# EasyEDA Pro project LF3.eprj

# Schematic Schematic1
Create Date: 2024-04-19; Page Name: P1; Project Name: LF3; Schematic Name: Schematic1; Update Date: 2025-01-10; Company: EasyEDA.com; Drawn: EasyEDA; Page Size: A4; Part Number: JLCPCB-002; Reviewed: EasyEDA; Version: V0.1
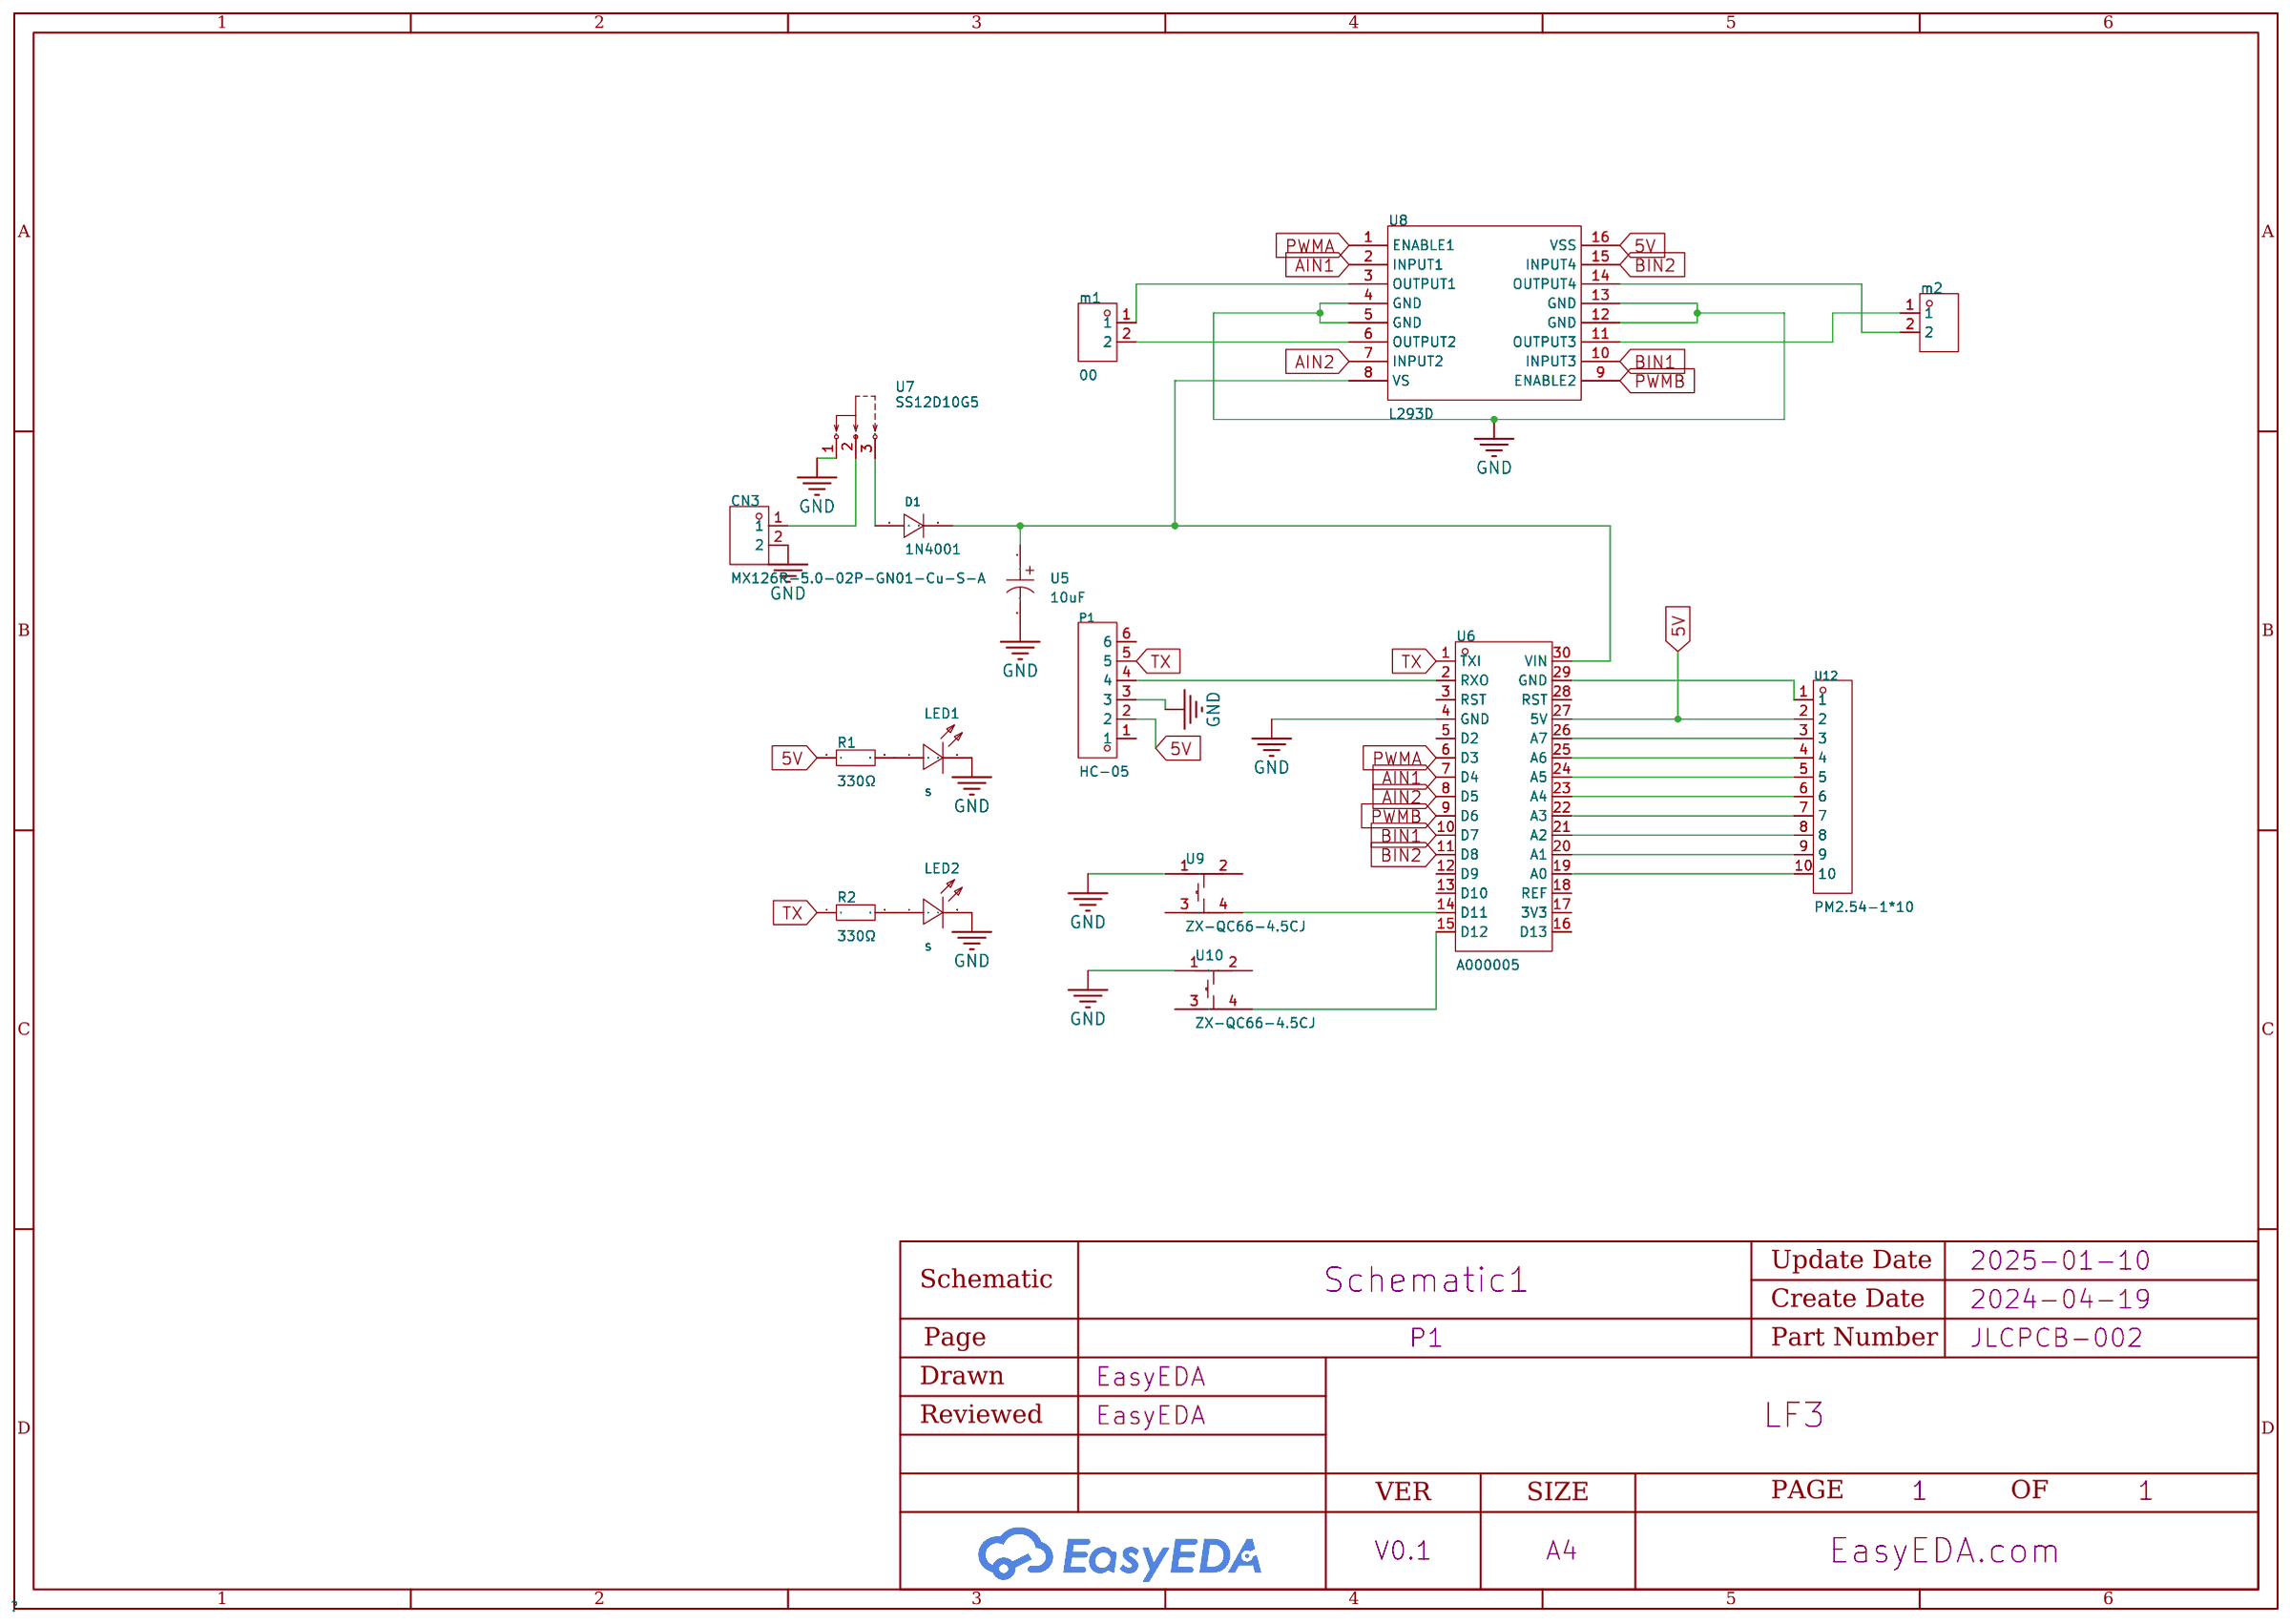
[diagram p0: schematic sheet]

## Parts
CN3  MX126R-5.0-02P-GN01-Cu-S-A  [CONN-TH_2P-P5.00-L10.0-W10.3]
D1  1N4001  [DO-41_BD2.4-L4.7-P8.70-D0.9-RD]
LED1  s  [LED-TH_BD3.8-P2.54-FD]
LED2  s  [LED-TH_BD3.8-P2.54-FD]
m1  00  [CONN-TH_2P-P5.00-L10.0-W10.3]
m2  MX126R-5.0-02P-GN01-Cu-S-A  [CONN-TH_2P-P5.00-L10.0-W10.3]
P1  HC-05  [HDR-TH_6P-P2.54-V-F]
R1  330Ω  [RES-TH_BD1.9-L3.3-P7.30-D0.5]
R2  330Ω  [RES-TH_BD1.9-L3.3-P7.30-D0.5]
U5  10uF  [CAP-TH_BD5.0-P2.00-D0.5-FD]
U6  A000005  [COMM-TH_A000005]
U7  SS12D10G5  [SW-TH_SHOU-HAN_SS12D10G4]
U8  L293D  [DIP-16_L20.0-W6.4-P2.54-LS7.6-BL]
U9  ZX-QC66-4.5CJ  [KEY-TH_4P-L6.0-W6.0-P4.50-LS6.50]
U10  ZX-QC66-4.5CJ  [KEY-TH_4P-L6.0-W6.0-P4.50-LS6.50]
U12  PM2.54-1*10  [HDR-TH_10P-P2.54-V-F]

## Library data of the parts
CN3 m1 m2 = MX126R-5.0-02P-GN01-Cu-S-A: Structure:1x2P Pitch:5mm Color:Green Mounting Style:Right-Angle Current Rating (Max):10A Voltage Rating (Max):300V Number of Pins:2P Number of Rows:1 Wire Gauge - AWG:14~26 Wire Gauge - AWG:14~26 Wire Gauge - mm2:2.5 Wire Gauge - mm2:2.5 Number of PINs Pe; LCSC Part Name: 5mm 1x2P 排数:1 每排P数:2 弯插; Supplier Part: C5188436; Manufacturer: MAX(迈旭); Supplier Footprint: 弯插,P=5mm; JLCPCB Part Class: Extended Part; Datasheet: https://atta.szlcsc.com/upload/public/pdf/source/20230914/18F586B283DF68255D5688C19743BDDA.pdf; Supplier: LCSC; Structure: 1x2P; Pitch: 5mm; Color: Green; Mounting Style: Right-Angle; Current Rating (Max): 10A; Voltage Rating (Max): 300V; Number of Pins: 2P; Number of Rows: 1; Wire Gauge - AWG: 14~26; Wire Gauge - mm2: 2.5; Number of PINs Per Row: 2; Contact Material: Copper Alloy; Contact Plating: Tin; Operating Temperature Range: -40℃~+105℃
D1 = 1N4001_C169150: Diode Configuration: Forward Voltage (Vf@If): Reverse Voltage (Vr): Average Rectified Current (Io): Reverse Leakage Current:; LCSC Part Name: 电压:50V 电流:1A; Supplier Part: C169150; Manufacturer: DIOFIT(對餘科技); Supplier Footprint: DO-41; JLCPCB Part Class: Extended Part; Datasheet: https://atta.szlcsc.com/upload/public/pdf/source/20180130/C169150_15172973997661323403.pdf; Supplier: LCSC
LED1 LED2 = TJ-L3FYTLDRMFCSFLC2R-A5: Lamp Holder Type:3mm圆形灯头 Emitted Color:橙红色 Power Dissipation:72mW Forward Current:20mA Dominant Wavelength:620nm~630nm Dominant Wavelength:620nm~630nm Peak Wavelength:630nm Diode Configuration:- Lens Color:雾状红透镜 Color Temperature:- Color Temperature:- Vie; LCSC Part Name: 橙红; Supplier Part: C440523; Manufacturer: TOGIALED(统佳); Supplier Footprint: 插件,D=3mm; JLCPCB Part Class: Extended Part; Datasheet: https://atta.szlcsc.com/upload/public/pdf/source/20191029/C440523_9662C3EC1D82ED90715B43211F389690.pdf; Supplier: LCSC; Lamp Holder Type: 3mm圆形灯头; Emitted Color: 橙红色; Power Dissipation: 72mW; Forward Current: 20mA; Dominant Wavelength: 620nm~630nm; Peak Wavelength: 630nm; Lens Color: 雾状红透镜; Viewing Angle: 45°; Operating Temperature: -20℃~+80℃
P1 = 2.54-1*6P母: Holes Structure:1x6P Pitch:2.54mm Row Spacing:- Mounting Type:Straight Number of Rows:Plugin Number of Holes:6P Insulation Height:- Contact Material:- Contact Plating:-; LCSC Part Name: 间距:2.54mm 1x6P 直插; Supplier Part: C40877; Manufacturer: BOOMELE(博穆精密); Supplier Footprint: 插件,P=2.54mm; JLCPCB Part Class: Extended Part; Datasheet: https://atta.szlcsc.com/upload/public/pdf/source/20210301/C2718488_F4427B881E42CAA8DDB0B1C12B3A522C.pdf; Supplier: LCSC; Holes Structure: 1x6P; Pitch: 2.54mm; Mounting Type: Straight; Number of Rows: Plugin; Number of Holes: 6P
R1 R2 = RN16T25800F: Type:Metal Film Resistors Resistance: Tolerance:±1% Tolerance:±1% Overload Voltage (Max):250V Temperature Coefficient:±100ppm/℃ Temperature Coefficient:±100ppm/℃ Operating Temperature Range:-55℃~+155℃ Operating Temperature Range:-55℃~+155℃; LCSC Part Name: 金属膜电阻 580Ω ±1%; Supplier Part: C172577; Manufacturer: 大毅科技; Supplier Footprint: 插件; JLCPCB Part Class: Extended Part; Datasheet: https://atta.szlcsc.com/upload/public/pdf/source/20180301/C172697_15198943829781383924.pdf; Supplier: LCSC; Type: Metal Film Resistors; Tolerance: ±1%; Overload Voltage (Max): 250V; Temperature Coefficient: ±100ppm/℃; Operating Temperature Range: -55℃~+155℃
U5 = 152EC0400: Capacitance: Tolerance:±20% Tolerance:±20% Rated Voltage: Ripple Current:54mA@100kHz Equivalent Series Resistance(ESR):- Lead Spacing:2mm φD: L: Lifetime @ Temp:2000hrs@105℃ Operating Temperature:-40℃~+105℃ Operating Temperature:-40℃~+105℃; LCSC Part Name: 10uF ±20% 50V; Supplier Part: C6718381; Manufacturer: KNSCHA(科尼盛); Supplier Footprint: 插件,D5xL11mm; JLCPCB Part Class: Extended Part; Datasheet: https://atta.szlcsc.com/upload/public/pdf/source/20230526/9565C444B97D7BF0133FD5A83BACB2AC.pdf; Supplier: LCSC; Tolerance: ±20%; Ripple Current: 54mA@100kHz; Lead Spacing: 2mm; Lifetime @ Temp: 2000hrs@105℃; Operating Temperature: -40℃~+105℃
U6 = A000005: Supplier Part: C19189484; Manufacturer: arduino; JLCPCB Part Class: Extended Part; Datasheet: https://atta.szlcsc.com/upload/public/pdf/source/20240327/42B4B7387607EBC2A03270056B7E63CD.pdf; Supplier: LCSC
U7 = SS12D10G5: Circuit:SPDT Switch Length:12.7mm Switch Width:6.7mm Mounting Style:Straight Current Rating (DC):2A Voltage Rating (DC):125V Mechanical Life:3千次 Operating Temperature:-25℃~+70℃ Operating Temperature:-25℃~+70℃; LCSC Part Name: 两档立式插件 3脚拨动开关 柄长5.0mm; Supplier Part: C7431054; Manufacturer: SHOU HAN(首韩); Supplier Footprint: 插件; JLCPCB Part Class: Extended Part; Datasheet: https://atta.szlcsc.com/upload/public/pdf/source/20231130/7A3DB6A149BF0A1DCFFE64FFC07FE434.pdf; Supplier: LCSC; Circuit: SPDT; Switch Length: 12.7mm; Switch Width: 6.7mm; Mounting Style: Straight; Current Rating (DC): 2A; Voltage Rating (DC): 125V; Mechanical Life: 3千次; Operating Temperature: -25℃~+70℃
U8 = L293D_C12340: LCSC Part Name: 600mA 有刷直流电机驱动芯片 36V; Supplier Part: C12340; Manufacturer: ST(意法半导体); Supplier Footprint: DIP-16; JLCPCB Part Class: Extended Part; Datasheet: https://atta.szlcsc.com/upload/public/pdf/source/20140724/1457707157802.pdf; Supplier: LCSC
U9 U10 = ZX-QC66-4.5CJ: Circuit:SPST Actuator Style:Round Button Operating Force:260gf Mounting Style:Straight Switch Length:6mm Switch Width:6mm Switch Height:4.5mm Strike Gundam:不带 Contact Current:50mA Voltage Rating (AC):250V Voltage Rating (DC):12V Insulation Resistance:100M; LCSC Part Name: 6*6*4.5插件; Supplier Part: C7470126; Manufacturer: Megastar(兆星); Supplier Footprint: DIP; JLCPCB Part Class: Extended Part; Datasheet: https://atta.szlcsc.com/upload/public/pdf/source/20230724/0479A79E9E9E89332649172D0D0A4CE7.pdf; Supplier: LCSC; Circuit: SPST; Actuator Style: Round Button; Operating Force: 260gf; Mounting Style: Straight; Switch Length: 6mm; Switch Width: 6mm; Switch Height: 4.5mm; Strike Gundam: 不带; Contact Current: 50mA; Voltage Rating (AC): 250V; Voltage Rating (DC): 12V; Insulation Resistance: 100MΩ; Actuator/Cap Color: Black; Pin Style: PCPin; Mechanical Life: 10万次; Operating Temperature: -30℃~+80℃
U12 = PM2.54-1*10: Holes Structure:1x10P Pitch:2.54mm Row Spacing:2.54mm Circular Hole / Square Hole:方孔 Mounting Type:Straight Number of Rows:Plugin Number of Holes:10P Current Rating (Max):2.5A Holes Direction:Top Insulation Height:8.5mm Operating Temperature Range:-40℃~+1; LCSC Part Name: 间距:2.54mm 1x10P 直插; Supplier Part: C5116489; Manufacturer: ZHOURI(洲日); Supplier Footprint: 插件,P=2.54mm; JLCPCB Part Class: Extended Part; Datasheet: https://atta.szlcsc.com/upload/public/pdf/source/20220803/0A90D5F6AD0A236C4C7DDEE7A7CA5EA3.pdf; Supplier: LCSC; Holes Structure: 1x10P; Pitch: 2.54mm; Row Spacing: 2.54mm; Circular Hole / Square Hole: 方孔; Mounting Type: Straight; Number of Rows: Plugin; Number of Holes: 10P; Current Rating (Max): 2.5A; Holes Direction: Top; Insulation Height: 8.5mm; Operating Temperature Range: -40℃~+105℃

## Nets
5V: P1.2 R1.1 U6.27(5V) U8.16(VSS) U12.2
GND: CN3.2 LED1.2(K) LED2.2(K) P1.3 U5.2 U6.4(GND) U7.1 U8.4(GND) U8.5(GND) U8.12(GND) U8.13(GND) U9.1 U10.1
AIN1: U6.7(D4) U8.2(INPUT1)
AIN2: U6.8(D5) U8.7(INPUT2)
BIN1: U6.10(D7) U8.10(INPUT3)
BIN2: U6.11(D8) U8.15(INPUT4)
PWMA: U6.6(D3) U8.1(ENABLE1)
PWMB: U6.9(D6) U8.9(ENABLE2)
TX: P1.5 R2.1 U6.1(TXI)
$1N1710: CN3.1 U7.2
$1N2163: m1.1 U8.3(OUTPUT1)
$1N2165: m1.2 U8.6(OUTPUT2)
$1N4572: U6.14(D11) U9.4
$1N4575: U6.15(D12) U10.4
$1N4782: D1.2 U7.3
$1N4796: LED1.1(A) R1.2
$1N6981: m2.1 U8.11(OUTPUT3)
$1N6982: m2.2 U8.14(OUTPUT4)
$1N7147: LED2.1(A) R2.2
$1N7508: P1.4 U6.2(RXO)
$1N8320: D1.1 U5.1 U6.30(VIN) U8.8(VS)
$1N8332: U6.29(GND) U12.1
$1N8342: U6.26(A7) U12.3
$1N8345: U6.25(A6) U12.4
$1N8348: U6.24(A5) U12.5
$1N8351: U6.23(A4) U12.6
$1N8354: U6.22(A3) U12.7
$1N8357: U6.21(A2) U12.8
$1N8360: U6.20(A1) U12.9
$1N8366: U6.19(A0) U12.10

Not connected (* = marked no-connect by the designer): P1 1 6; U6 3(RST) 5(D2) 12(D9) 13(D10) 16(D13) 17(3V3) 18(REF) 28(RST); U9 2 3; U10 2 3

# Board PCB4
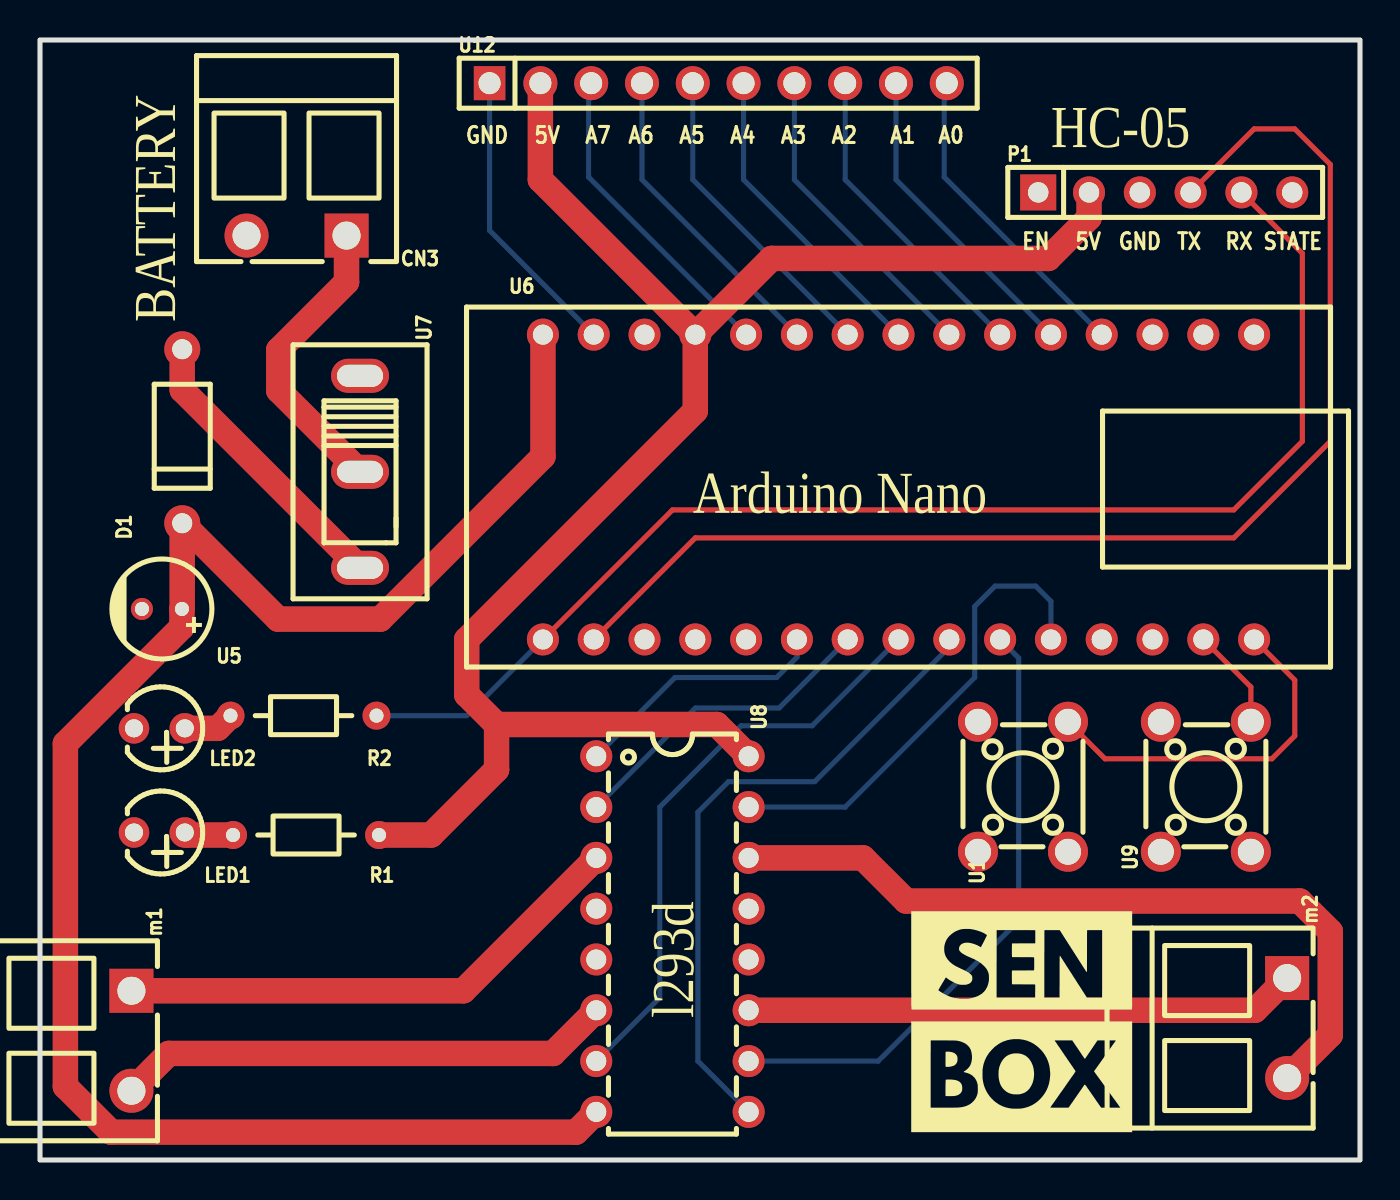
[diagram p1: board, top side]
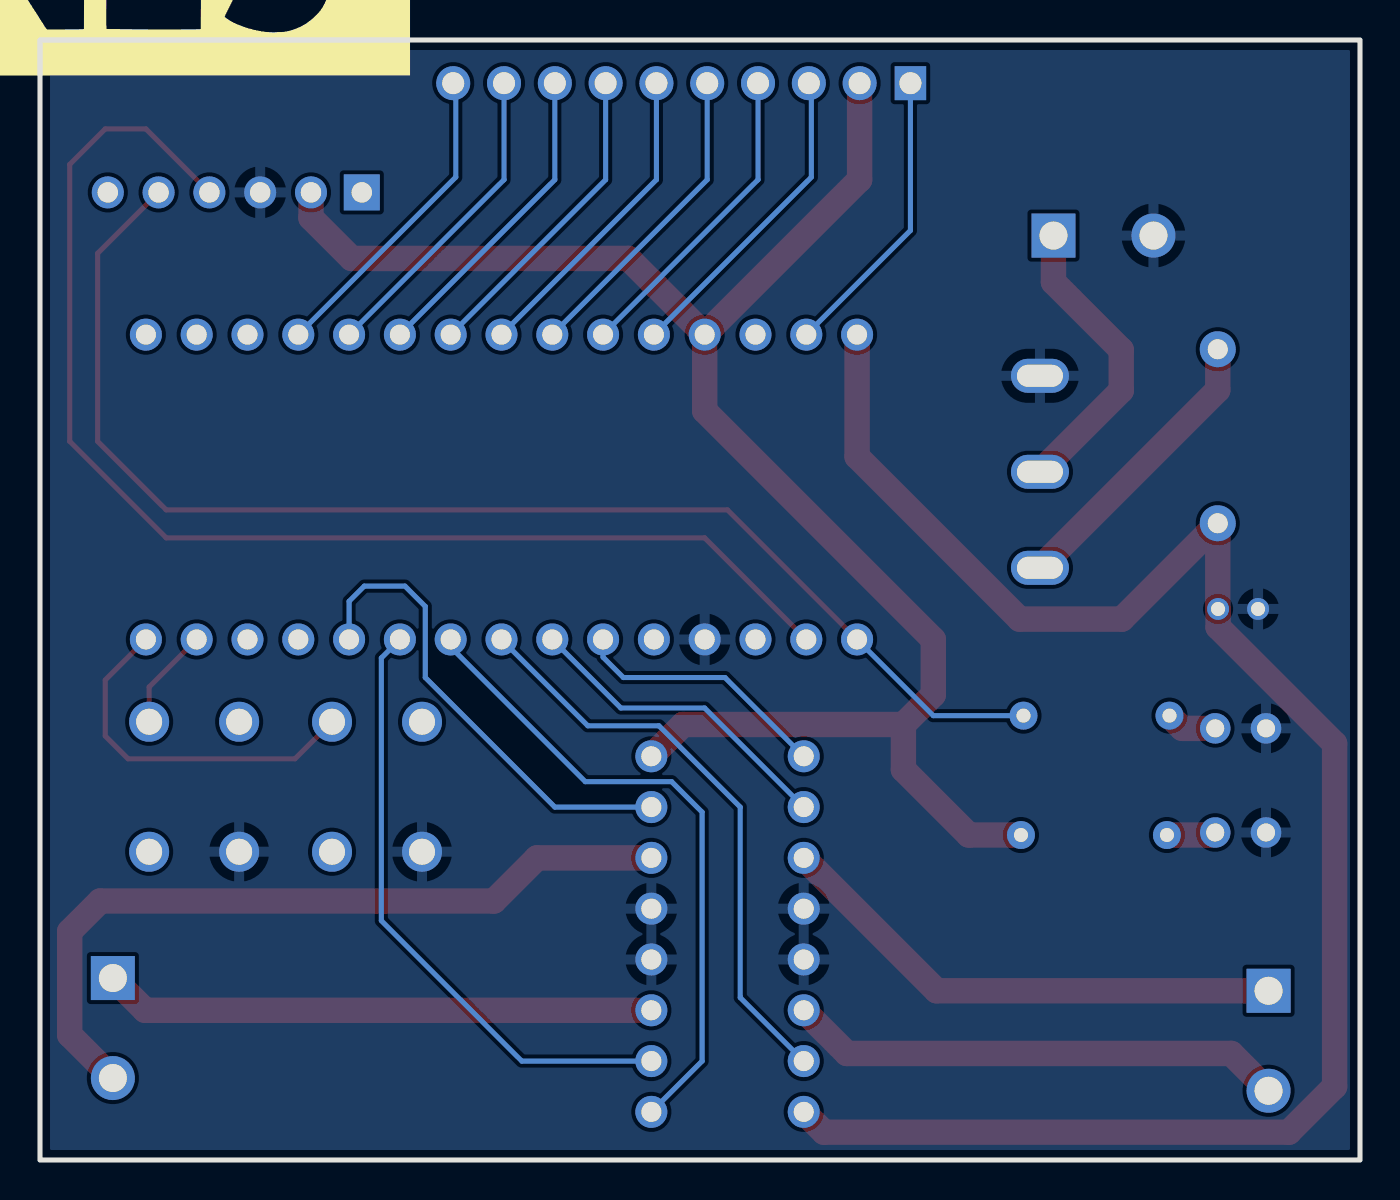
[diagram p2: board, bottom side, seen from below]

Outline 66 x 56 mm; copper layers: Top Layer, Bottom Layer. Coordinates in mm from the lower left corner of the outline.
Outline path: rectangle 0,56 66,0
Stack: Top Layer 0.035mm / Dielectric1 1.51mm FR4 er 4.5 / Bottom Layer 0.035mm

## Design rules (mm)
template: JLCPCB Capability(Two Layers Board)
spacing copperThickness1oz (default): track to track 0.102, other pairs 0.152 to 0.3
spacing copperThickness2oz: track to track 0.203, other pairs 0.152 to 0.3
track width copperThickness1oz (default): min 0.127, default 0.254, max 2.54
track width copperThickness2oz: min 0.203, default 0.254, max 2.54
differential pair differentialPair (default): width min 0.127, default 0.254, max 2.54; gap min 0.152, default 0.152
via viaSize (default): diameter min 0.5, default 0.61, max 10; hole min 0.3, default 0.305, max 6.3

## Placement (name value [footprint] x y rotation side)
CN3  MX126R-5.0-02P-GN01-Cu-S-A  [CONN-TH_2P-P5.00-L10.0-W10.3]  12.83 46.22 180 top
D1  1N4001  [DO-41_BD2.4-L4.7-P8.70-D0.9-RD]  7.11 36.19 90 top
LED1  s  [LED-TH_BD3.8-P2.54-FD]  5.97 16.38 180 top
LED2  s  [LED-TH_BD3.8-P2.54-FD]  5.97 21.58 180 top
m1  00  [CONN-TH_2P-P5.00-L10.0-W10.3]  4.57 5.96 270 top
m2  MX126R-5.0-02P-GN01-Cu-S-A  [CONN-TH_2P-P5.00-L10.0-W10.3]  62.36 6.6 270 top
P1  HC-05  [HDR-TH_6P-P2.54-V-F]  56.26 48.38 0 top
R1  330Ω  [RES-TH_BD1.9-L3.3-P7.30-D0.5]  13.3 16.25 180 top
R2  330Ω  [RES-TH_BD1.9-L3.3-P7.30-D0.5]  13.18 22.22 180 top
U5  10uF  [CAP-TH_BD5.0-P2.00-D0.5-FD]  6.1 27.55 180 top
U6  A000005  [COMM-TH_A000005]  42.93 33.65 0 top
U7  SS12D10G5  [SW-TH_SHOU-HAN_SS12D10G4]  16 34.41 270 top
U8  L293D  [DIP-16_L20.0-W6.4-P2.54-LS7.6-BL]  31.62 11.3 270 top
U9  ZX-QC66-4.5CJ  [KEY-TH_4P-L6.0-W6.0-P4.50-LS6.50]  58.29 18.66 90 top
U10  ZX-QC66-4.5CJ  [KEY-TH_4P-L6.0-W6.0-P4.50-LS6.50]  49.15 18.66 90 top
U12  PM2.54-1*10  [HDR-TH_10P-P2.54-V-F]  33.91 53.84 0 top

## Footprints (pads in the part's own frame, mm; a bottom-side part is the same pattern mirrored in y, then rotated)
CAP-TH_BD5.0-P2.00-D0.5-FD
  round 1.1 hole 0.7: 1(-1,0) 2(1,0)
COMM-TH_A000005
  round 1.6 hole 1: 1(-17.78,-7.62) 2(-15.24,-7.62) 3(-12.7,-7.62) 4(-10.16,-7.62) 5(-7.62,-7.62) 6(-5.08,-7.62) 7(-2.54,-7.62) 8(0,-7.62) 9(2.54,-7.62) 10(5.08,-7.62) 11(7.62,-7.62) 12(10.16,-7.62) 13(12.7,-7.62) 14(15.24,-7.62) 15(17.78,-7.62) 16(17.78,7.62) 17(15.24,7.62) 18(12.7,7.62) 19(10.16,7.62) 20(7.62,7.62) 21(5.08,7.62) 22(2.54,7.62) 23(0,7.62) 24(-2.54,7.62) 25(-5.08,7.62) 26(-7.62,7.62) 27(-10.16,7.62) 28(-12.7,7.62) 29(-15.24,7.62) 30(-17.78,7.62)
CONN-TH_2P-P5.00-L10.0-W10.3
  rect 2.2x2.2 hole 1.4: 1(-2.5,0)
  round 2.2 hole 1.4: 2(2.5,0)
DIP-16_L20.0-W6.4-P2.54-LS7.6-BL
  round 1.6 hole 1: 1(-8.89,-3.81) 2(-6.35,-3.81) 3(-3.81,-3.81) 4(-1.27,-3.81) 5(1.27,-3.81) 6(3.81,-3.81) 7(6.35,-3.81) 8(8.89,-3.81) 9(8.89,3.81) 10(6.35,3.81) 11(3.81,3.81) 12(1.27,3.81) 13(-1.27,3.81) 14(-3.81,3.81) 15(-6.35,3.81) 16(-8.89,3.81)
DO-41_BD2.4-L4.7-P8.70-D0.9-RD
  round 1.8 hole 1: 1(-4.35,0) 2(4.35,0)
HDR-TH_6P-P2.54-V-F
  rect 1.8x1.8 hole 1.02: 1(-6.35,0)
  round 1.6 hole 1.02: 2(-3.81,0) 3(-1.27,0) 4(1.27,0) 5(3.81,0) 6(6.35,0)
HDR-TH_10P-P2.54-V-F
  rect 1.575x1.7 hole 1.1: 1(-11.43,0)
  round 1.7 hole 1.1: 2(-8.89,0) 3(-6.35,0) 4(-3.81,0) 5(-1.27,0) 6(1.27,0) 7(3.81,0) 8(6.35,0) 9(8.89,0) 10(11.43,0)
KEY-TH_4P-L6.0-W6.0-P4.50-LS6.50
  round 2 hole 1.3: 1(-3.25,2.25) 2(3.25,2.25) 3(-3.25,-2.25) 4(3.25,-2.25)
LED-TH_BD3.8-P2.54-FD
  round 1.524 hole 0.9: 1(-1.27,0) 2(1.27,0)
RES-TH_BD1.9-L3.3-P7.30-D0.5
  round 1.4 hole 0.7: 1(-3.65,0) 2(3.65,0)
SW-TH_SHOU-HAN_SS12D10G4
  oval 1.7x2.9 hole 1.1x2.3: 1(-4.8,0) 2(0,0) 3(4.8,0)

## Nets
As in the schematic.

Pads without a net: P1 1 6; U6 3 5 12 13 16 17 18 28; U9 2 3; U10 2 3

## Routing (per net, layer and track width the routed paths; a pad name or vN(x,y) marks a point on that pad's centre or on a via; arc(x,y) is an arc through that point)
5V: length 86.8
  Top Layer w1.27: U8.16 33.85,21.77 22.83,21.77 ; 22.83,21.77 21.34,23.27 21.34,26.03 32.77,37.46 U6.27 ; 22.83,21.77 22.83,19.52 19.56,16.25 R1.1 ; U12.2 25.02,49.02 U6.27 ; U6.27 36.58,45.08 50.42,45.08 52.45,47.11 P1.2
AIN1: length 16
  Bottom Layer w0.254: U8.2 32.77,22.6 36.96,22.6 U6.7
AIN2: length 29.4
  Bottom Layer w0.254: U8.7 30.99,8.12 30.99,17.65 35.05,21.71 38.61,21.71 U6.8
BIN1: length 30.9
  Bottom Layer w0.254: U8.10 41.91,4.95 48.93,11.97 48.93,25.1 U6.10
BIN2: length 24
  Bottom Layer w0.254: U6.11 50.55,27.93 49.78,28.69 47.75,28.69 46.74,27.68 46.74,24.12 40.26,17.65 U8.15
PWMA: length 13
  Bottom Layer w0.254: U8.1 31.75,24.12 36.83,24.12 37.85,25.14 U6.6
PWMB: length 32.4
  Bottom Layer w0.254: U6.9 45.47,25.65 38.73,18.92 34.42,18.92 32.89,17.39 32.89,4.95 U8.9
TX: length 65.7
  Top Layer w0.254: P1.5 63.12,45.33 63.12,35.93 59.69,32.5 31.62,32.5 U6.1
  Bottom Layer w0.254: R2.1 21.34,22.22 U6.1
$1N1710: length 14.9
  Top Layer w1.27: CN3.1 15.33,43.89 11.94,40.51 11.94,38.47 U7.2
$1N2163: length 26
  Top Layer w1.27: m1.1 21.17,8.46 U8.3
$1N2165: length 24.9
  Top Layer w1.27: U8.6 25.65,5.33 6.44,5.33 m1.2
$1N4572: length 5.1
  Top Layer w0.254: U6.14 60.54,23.65 U9.4
$1N4575: length 18.2
  Top Layer w0.254: U6.15 62.74,24 62.74,21.2 61.6,20.06 53.25,20.06 U10.4
$1N4782: length 14.6
  Top Layer w1.27: D1.2 7.11,38.5 U7.3
$1N4796: length 2.5
  Top Layer w1.27: LED1.1 7.37,16.25 R1.2
$1N6981: length 27.6
  Top Layer w1.27: m2.1 60.75,7.49 U8.11
$1N6982: length 38.8
  Top Layer w1.27: U8.14 41.15,15.11 43.31,12.95 62.99,12.95 64.52,11.42 64.52,6.26 m2.2
$1N7147: length 2.6
  Top Layer w1.27: LED2.1 8.89,21.58 9.53,22.22
$1N7508: length 63.8
  Top Layer w0.254: P1.4 60.71,51.55 62.74,51.55 64.52,49.78 64.52,35.93 59.69,31.11 32.77,31.11 U6.2
$1N8320: length 88
  Top Layer w1.27: U8.8 26.8,1.39 3.56,1.39 1.27,3.68 1.27,20.82 7.1,26.65 U5.1 7.11,27.57 7.11,31.84 11.91,27.04 17.02,27.04 25.15,35.17 U6.30
$1N8332: length 14.7
  Bottom Layer w0.254: U12.1 22.48,46.47 U6.29
$1N8342: length 15.9
  Bottom Layer w0.254: U12.3 27.43,53.71 27.43,49.14 U6.26
$1N8345: length 15.8
  Bottom Layer w0.254: U6.25 30.1,49.02 U12.4
$1N8348: length 15.8
  Bottom Layer w0.254: U12.5 32.64,49.02 U6.24
$1N8351: length 15.8
  Bottom Layer w0.254: U12.6 35.18,49.02 U6.23
$1N8354: length 15.8
  Bottom Layer w0.254: U12.7 37.72,49.02 U6.22
$1N8357: length 15.8
  Bottom Layer w0.254: U12.8 40.26,49.02 U6.21
$1N8360: length 15.8
  Bottom Layer w0.254: U12.9 42.8,49.02 U6.20
$1N8366: length 15.9
  Bottom Layer w0.254: U6.19 45.21,49.14 45.21,53.71 U12.10

## Copper pours and planes (outline as drawn; the poured copper is in the pictures)
GND on Bottom Layer: 0,56 66,56 66,0.21 0,0.21

## Text on the board
Top Silkscreen Layer: GND | 5V | A7 | A6 | A5 | A4 | A3 | A2 | A1 | A0 | EN | TX | RX | STATE | Arduino Nano | BATTERY | l293d | HC-05
